# Altium schematic sheet cpu.SchDoc
size A2
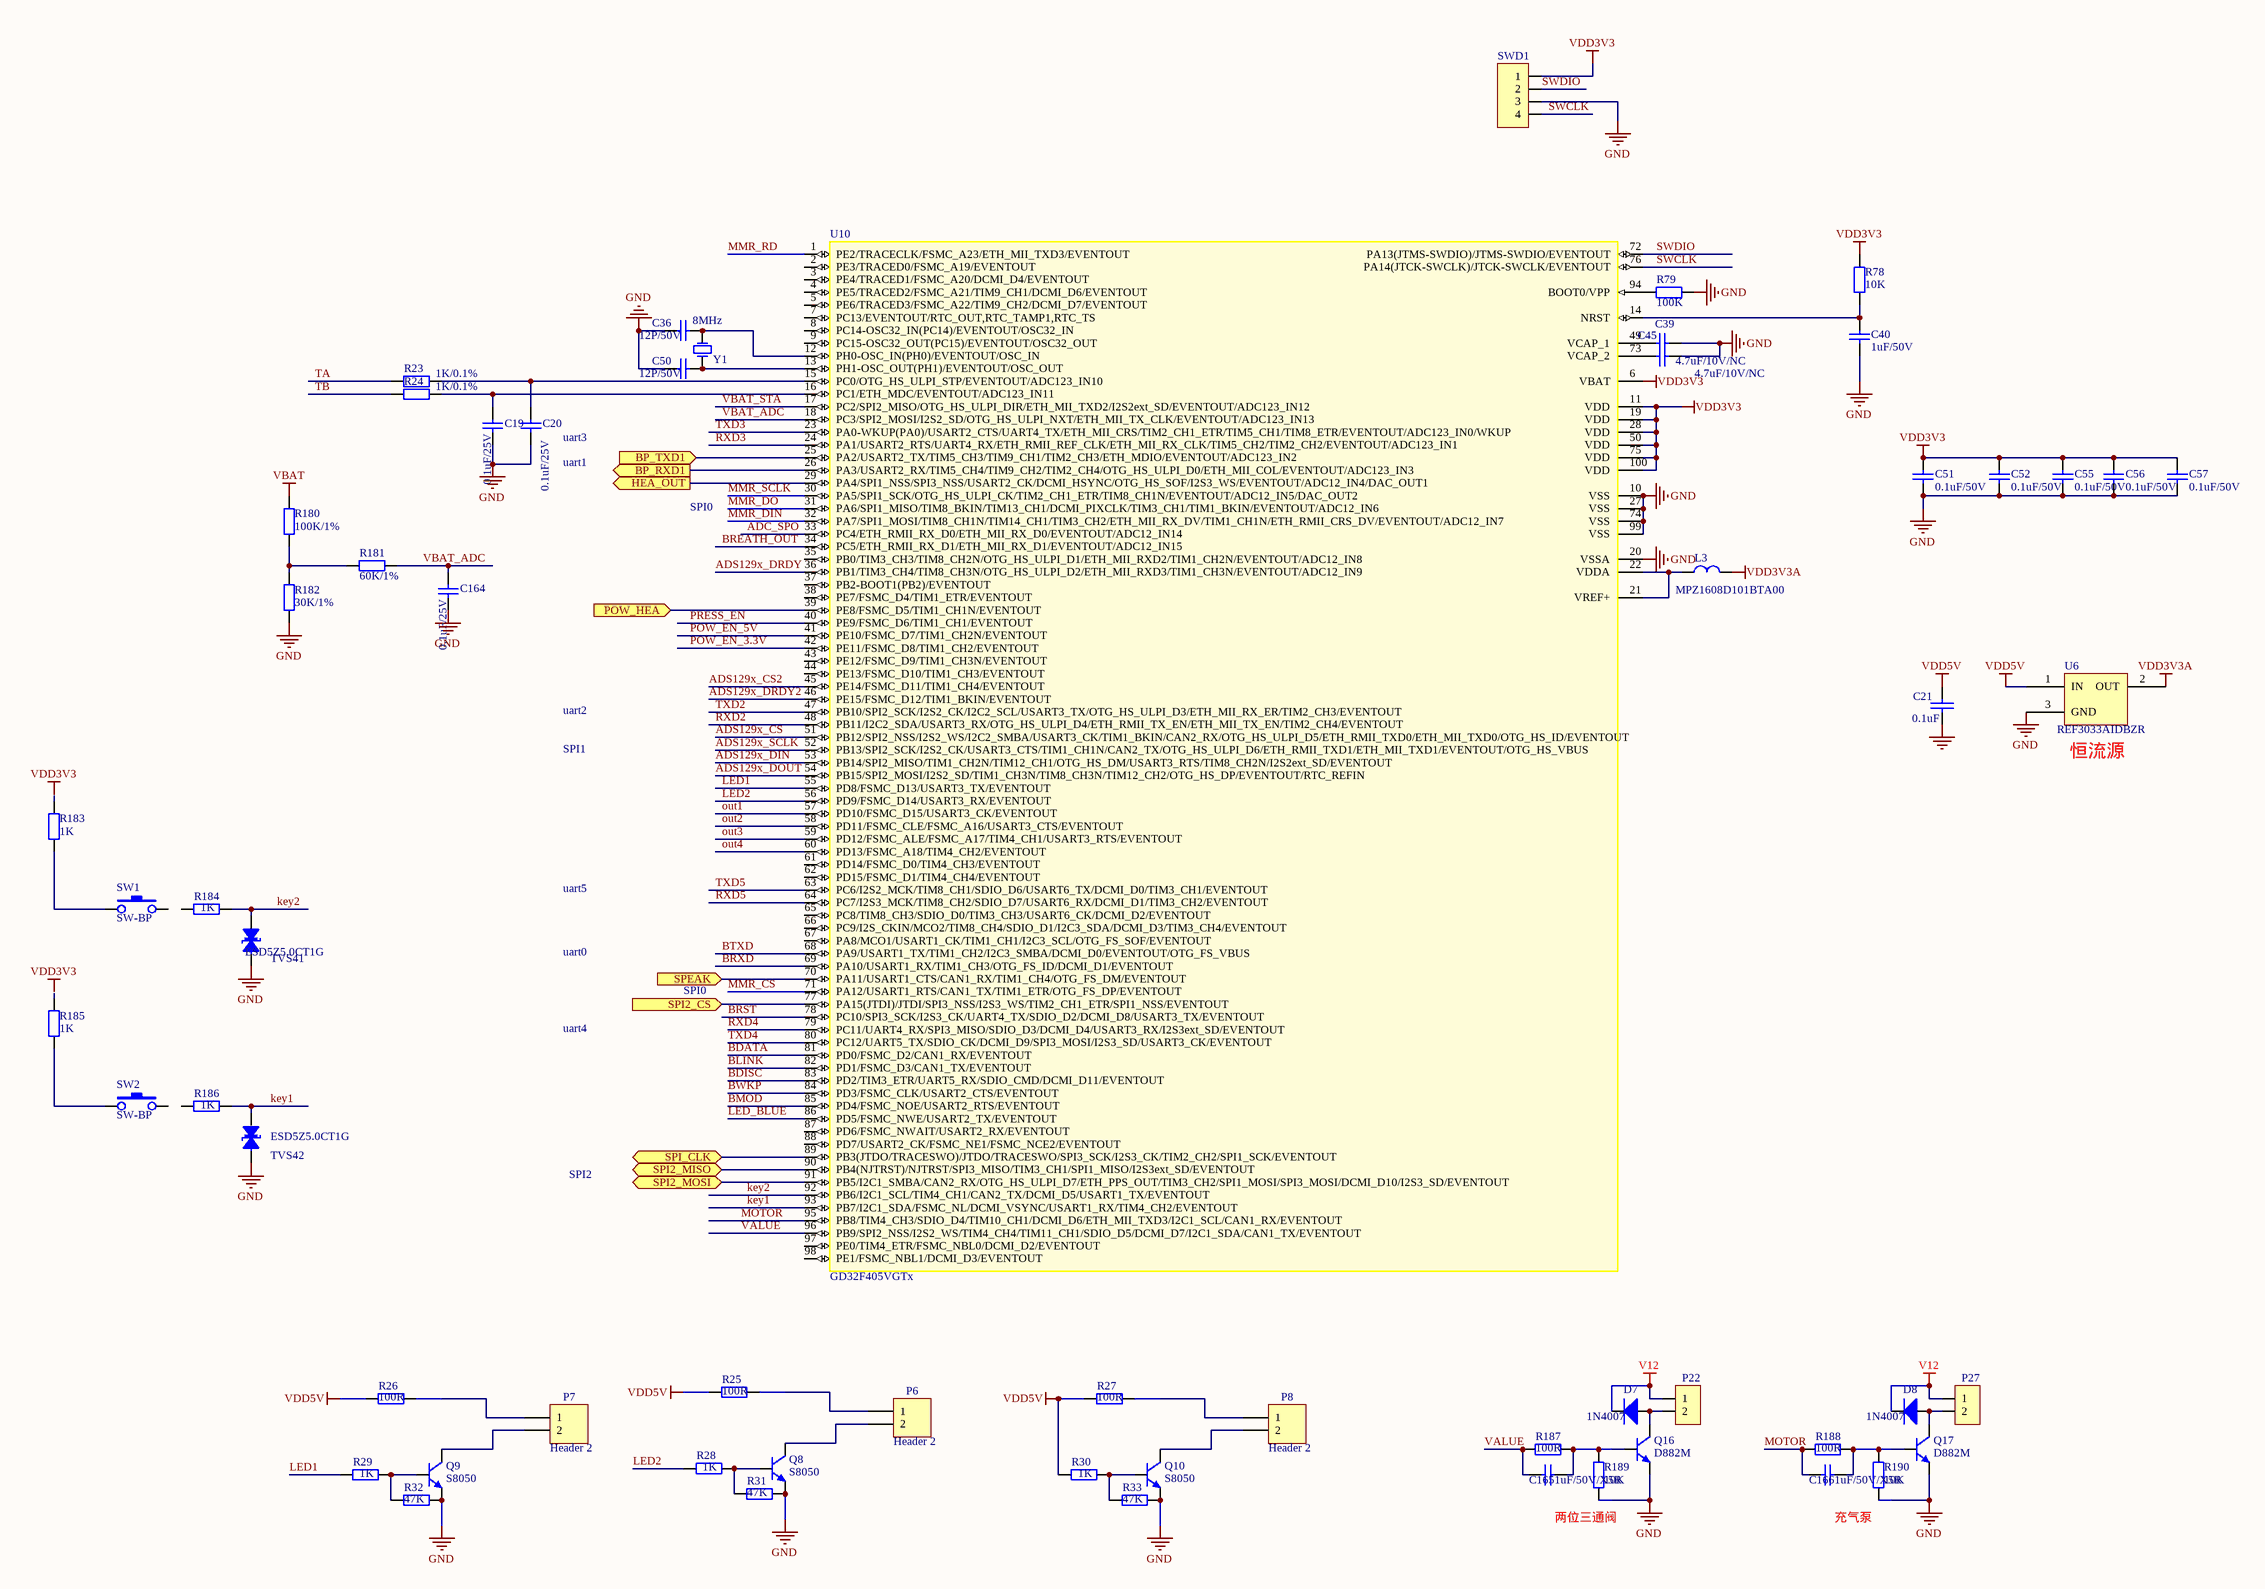
[diagram p0: cpu.SchDoc]

## Parts
C19  0.1uF/25V  [SMD-0603C]
C20  0.1uF/25V  [SMD-0603C]
C21  0.1uF  [0603C]
C36  12P/50V  [SMD-0603C]
C39  4.7uF/10V/NC  [SMD-0603C]
C40  1uF/50V  [SMD-0603C]
C45  4.7uF/10V/NC  [SMD-0603C]
C50  12P/50V  [SMD-0603C]
C51  0.1uF/50V  [SMD-0603C]
C52  0.1uF/50V  [SMD-0603C]
C55  0.1uF/50V  [SMD-0603C]
C56  0.1uF/50V  [SMD-0603C]
C57  0.1uF/50V  [SMD-0603C]
C164  0.1uF/25V  [SMD-0603C]
C165  1uF/50V/X5R  [SMD-0603C]
C166  1uF/50V/X5R  [SMD-0603C]
D7  1N4007  [DO-214-AC]
D8  1N4007  [DO-214-AC]
L3  MPZ1608D101BTA00  [SMD-0603]
P6  Header 2  [2X2.54MMZ]
P7  Header 2  [2X2.54MMZ]
P8  Header 2  [2X2.54MMZ]
P22  VH2.54-2P  [2X2.54MMZ]  (value not drawn)
P27  VH2.54-2P  [2X2.54MMZ]  (value not drawn)
Q8  S8050  [SOT-23]
Q9  S8050  [SOT-23]
Q10  S8050  [SOT-23]
Q16  D882M  [SOT-89-3]
Q17  D882M  [SOT-89-3]
R23  1K/0.1%  [SMD-0603]
R24  1K/0.1%  [SMD-0603]
R25  100R  [SMD-0805]
R26  100R  [SMD-0805]
R27  100R  [SMD-0805]
R28  1K  [SMD-0603]
R29  1K  [SMD-0603]
R30  1K  [SMD-0603]
R31  47K  [SMD-0603]
R32  47K  [SMD-0603]
R33  47K  [SMD-0603]
R78  10K  [SMD-0603]
R79  100K  [SMD-0603]
R180  100K/1%  [SMD-0603]
R181  60K/1%  [SMD-0603]
R182  30K/1%  [SMD-0603]
R183  1K  [SMD-0603]
R184  1K  [SMD-0603]
R185  1K  [SMD-0603]
R186  1K  [SMD-0603]
R187  100R  [SMD-0603]
R188  100R  [SMD-0603]
R189  10K  [SMD-0603]
R190  10K  [SMD-0603]
SW1  SW-BP  [KEY_4X4]
SW2  SW-BP  [KEY_4X4]
SWD1  SIP-4 (NC)  [SIP-4]  (value not drawn)
TVS41  ESD5Z5.0CT1G  [SOD-523]
TVS42  ESD5Z5.0CT1G  [SOD-523]
U6  REF3033AIDBZR  [SOT23-3]
U10  GD32F405VGTx  [STM-LQFP100_N]
Y1  8MHz  [XTAL-3225-2]

## Ports
BP_RXD1 (out), BP_TXD1 (in), HEA_OUT (out), POW_HEA (in), SPEAK (in), SPI2_CS (in), SPI2_MISO (bidir), SPI2_MOSI (bidir), SPI_CLK (bidir)

## Nets
GND: C19.2 C20.2 C21.2 C36.2 C39.1 C40.1 C45.1 C50.2 C51.1 C52.1 C55.1 C56.1 C57.1 C164.2 Q8.2(E) Q9.2(E) Q10.2(E) Q16.3(E) Q17.3(E) R31.2 R32.2 R33.2 R79.1 R182.2 R189.2 R190.2 SWD1.3 TVS41.2(B) TVS42.2(B) U6.3(GND) U10.10(VSS) U10.20(VSSA) U10.27(VSS) U10.74(VSS) U10.99(VSS)
V12: D7.2(K) D8.2(K) P22.1 P27.1
VBAT: R180.1
VDD3V3: C51.2 C52.2 C55.2 C56.2 C57.2 R78.2 SWD1.1 U10.6(VBAT) U10.11(VDD) U10.19(VDD) U10.28(VDD) U10.50(VDD) U10.75(VDD) U10.100(VDD)
VDD3V3A: L3.1 U6.2(OUT)
VDD5V: C21.1 R25.2 R26.2 R27.2 R30.1 U6.1(IN)
ADC_SPO: U10.33(PC4/ETH_RMII_RX_D0/ETH_MII_RX_D0/EVENTOUT/ADC12_IN14)
ADS129x_CS: U10.51(PB12/SPI2_NSS/I2S2_WS/I2C2_SMBA/USART3_CK/TIM1_BKIN/CAN2_RX/OTG_HS_ULPI_D5/ETH_RMII_TXD0/ETH_MII_TXD0/OTG_HS_ID/EVENTOUT)
ADS129x_CS2: U10.45(PE14/FSMC_D11/TIM1_CH4/EVENTOUT)
ADS129x_DIN: U10.53(PB14/SPI2_MISO/TIM1_CH2N/TIM12_CH1/OTG_HS_DM/USART3_RTS/TIM8_CH2N/I2S2ext_SD/EVENTOUT)
ADS129x_DOUT: U10.54(PB15/SPI2_MOSI/I2S2_SD/TIM1_CH3N/TIM8_CH3N/TIM12_CH2/OTG_HS_DP/EVENTOUT/RTC_REFIN)
ADS129x_DRDY: U10.36(PB1/TIM3_CH4/TIM8_CH3N/OTG_HS_ULPI_D2/ETH_MII_RXD3/TIM1_CH3N/EVENTOUT/ADC12_IN9)
ADS129x_DRDY2: U10.46(PE15/FSMC_D12/TIM1_BKIN/EVENTOUT)
ADS129x_SCLK: U10.52(PB13/SPI2_SCK/I2S2_CK/USART3_CTS/TIM1_CH1N/CAN2_TX/OTG_HS_ULPI_D6/ETH_RMII_TXD1/ETH_MII_TXD1/EVENTOUT/OTG_HS_VBUS)
BDATA: U10.81(PD0/FSMC_D2/CAN1_RX/EVENTOUT)
BDISC: U10.83(PD2/TIM3_ETR/UART5_RX/SDIO_CMD/DCMI_D11/EVENTOUT)
BLINK: U10.82(PD1/FSMC_D3/CAN1_TX/EVENTOUT)
BMOD: U10.85(PD4/FSMC_NOE/USART2_RTS/EVENTOUT)
BP_RXD1: U10.26(PA3/USART2_RX/TIM5_CH4/TIM9_CH2/TIM2_CH4/OTG_HS_ULPI_D0/ETH_MII_COL/EVENTOUT/ADC123_IN3) ; port BP_RXD1
BP_TXD1: U10.25(PA2/USART2_TX/TIM5_CH3/TIM9_CH1/TIM2_CH3/ETH_MDIO/EVENTOUT/ADC123_IN2) ; port BP_TXD1
BREATH_OUT: U10.34(PC5/ETH_RMII_RX_D1/ETH_MII_RX_D1/EVENTOUT/ADC12_IN15)
BRST: U10.78(PC10/SPI3_SCK/I2S3_CK/UART4_TX/SDIO_D2/DCMI_D8/USART3_TX/EVENTOUT)
BRXD: U10.69(PA10/USART1_RX/TIM1_CH3/OTG_FS_ID/DCMI_D1/EVENTOUT)
BTXD: U10.68(PA9/USART1_TX/TIM1_CH2/I2C3_SMBA/DCMI_D0/EVENTOUT/OTG_FS_VBUS)
BWKP: U10.84(PD3/FSMC_CLK/USART2_CTS/EVENTOUT)
HEA_OUT: U10.29(PA4/SPI1_NSS/SPI3_NSS/USART2_CK/DCMI_HSYNC/OTG_HS_SOF/I2S3_WS/EVENTOUT/ADC12_IN4/DAC_OUT1) ; port HEA_OUT
key1: R186.2 TVS42.1(A) U10.93(PB7/I2C1_SDA/FSMC_NL/DCMI_VSYNC/USART1_RX/TIM4_CH2/EVENTOUT)
key2: R184.2 TVS41.1(A) U10.92(PB6/I2C1_SCL/TIM4_CH1/CAN2_TX/DCMI_D5/USART1_TX/EVENTOUT)
LED1: R29.1 U10.55(PD8/FSMC_D13/USART3_TX/EVENTOUT)
LED2: R28.1 U10.56(PD9/FSMC_D14/USART3_RX/EVENTOUT)
LED_BLUE: U10.86(PD5/FSMC_NWE/USART2_TX/EVENTOUT)
MMR_CS: U10.71(PA12/USART1_RTS/CAN1_TX/TIM1_ETR/OTG_FS_DP/EVENTOUT)
MMR_DIN: U10.32(PA7/SPI1_MOSI/TIM8_CH1N/TIM14_CH1/TIM3_CH2/ETH_MII_RX_DV/TIM1_CH1N/ETH_RMII_CRS_DV/EVENTOUT/ADC12_IN7)
MMR_DO: U10.31(PA6/SPI1_MISO/TIM8_BKIN/TIM13_CH1/DCMI_PIXCLK/TIM3_CH1/TIM1_BKIN/EVENTOUT/ADC12_IN6)
MMR_RD: U10.1(PE2/TRACECLK/FSMC_A23/ETH_MII_TXD3/EVENTOUT)
MMR_SCLK: U10.30(PA5/SPI1_SCK/OTG_HS_ULPI_CK/TIM2_CH1_ETR/TIM8_CH1N/EVENTOUT/ADC12_IN5/DAC_OUT2)
MOTOR: C166.2 R188.2 U10.95(PB8/TIM4_CH3/SDIO_D4/TIM10_CH1/DCMI_D6/ETH_MII_TXD3/I2C1_SCL/CAN1_RX/EVENTOUT)
out1: U10.57(PD10/FSMC_D15/USART3_CK/EVENTOUT)
out2: U10.58(PD11/FSMC_CLE/FSMC_A16/USART3_CTS/EVENTOUT)
out3: U10.59(PD12/FSMC_ALE/FSMC_A17/TIM4_CH1/USART3_RTS/EVENTOUT)
out4: U10.60(PD13/FSMC_A18/TIM4_CH2/EVENTOUT)
POW_EN_3.3V: U10.42(PE11/FSMC_D8/TIM1_CH2/EVENTOUT)
POW_EN_5V: U10.41(PE10/FSMC_D7/TIM1_CH2N/EVENTOUT)
POW_HEA: U10.39(PE8/FSMC_D5/TIM1_CH1N/EVENTOUT) ; port POW_HEA
PRESS_EN: U10.40(PE9/FSMC_D6/TIM1_CH1/EVENTOUT)
RXD2: U10.48(PB11/I2C2_SDA/USART3_RX/OTG_HS_ULPI_D4/ETH_RMII_TX_EN/ETH_MII_TX_EN/TIM2_CH4/EVENTOUT)
RXD3: U10.24(PA1/USART2_RTS/UART4_RX/ETH_RMII_REF_CLK/ETH_MII_RX_CLK/TIM5_CH2/TIM2_CH2/EVENTOUT/ADC123_IN1)
RXD4: U10.79(PC11/UART4_RX/SPI3_MISO/SDIO_D3/DCMI_D4/USART3_RX/I2S3ext_SD/EVENTOUT)
RXD5: U10.64(PC7/I2S3_MCK/TIM8_CH2/SDIO_D7/USART6_RX/DCMI_D1/TIM3_CH2/EVENTOUT)
SPEAK: U10.70(PA11/USART1_CTS/CAN1_RX/TIM1_CH4/OTG_FS_DM/EVENTOUT) ; port SPEAK
SPI2_CS: U10.77(PA15(JTDI)/JTDI/SPI3_NSS/I2S3_WS/TIM2_CH1_ETR/SPI1_NSS/EVENTOUT) ; port SPI2_CS
SPI2_MISO: U10.90(PB4(NJTRST)/NJTRST/SPI3_MISO/TIM3_CH1/SPI1_MISO/I2S3ext_SD/EVENTOUT) ; port SPI2_MISO
SPI2_MOSI: U10.91(PB5/I2C1_SMBA/CAN2_RX/OTG_HS_ULPI_D7/ETH_PPS_OUT/TIM3_CH2/SPI1_MOSI/SPI3_MOSI/DCMI_D10/I2S3_SD/EVENTOUT) ; port SPI2_MOSI
SPI_CLK: U10.89(PB3(JTDO/TRACESWO)/JTDO/TRACESWO/SPI3_SCK/I2S3_CK/TIM2_CH2/SPI1_SCK/EVENTOUT) ; port SPI_CLK
SWCLK: SWD1.4 U10.76(PA14(JTCK-SWCLK)/JTCK-SWCLK/EVENTOUT)
SWDIO: SWD1.2 U10.72(PA13(JTMS-SWDIO)/JTMS-SWDIO/EVENTOUT)
TA: R23.2
TB: R24.2
TXD2: U10.47(PB10/SPI2_SCK/I2S2_CK/I2C2_SCL/USART3_TX/OTG_HS_ULPI_D3/ETH_MII_RX_ER/TIM2_CH3/EVENTOUT)
TXD3: U10.23(PA0-WKUP(PA0)/USART2_CTS/UART4_TX/ETH_MII_CRS/TIM2_CH1_ETR/TIM5_CH1/TIM8_ETR/EVENTOUT/ADC123_IN0/WKUP)
TXD4: U10.80(PC12/UART5_TX/SDIO_CK/DCMI_D9/SPI3_MOSI/I2S3_SD/USART3_CK/EVENTOUT)
TXD5: U10.63(PC6/I2S2_MCK/TIM8_CH1/SDIO_D6/USART6_TX/DCMI_D0/TIM3_CH1/EVENTOUT)
VALUE: C165.2 R187.2 U10.96(PB9/SPI2_NSS/I2S2_WS/TIM4_CH4/TIM11_CH1/SDIO_D5/DCMI_D7/I2C1_SDA/CAN1_TX/EVENTOUT)
VBAT_ADC: C164.1 R181.2 U10.18(PC3/SPI2_MOSI/I2S2_SD/OTG_HS_ULPI_NXT/ETH_MII_TX_CLK/EVENTOUT/ADC123_IN13)
VBAT_STA: U10.17(PC2/SPI2_MISO/OTG_HS_ULPI_DIR/ETH_MII_TXD2/I2S2ext_SD/EVENTOUT/ADC123_IN12)
NetC19_1: C19.1 R24.1 U10.16(PC1/ETH_MDC/EVENTOUT/ADC123_IN11)
NetC20_1: C20.1 R23.1 U10.15(PC0/OTG_HS_ULPI_STP/EVENTOUT/ADC123_IN10)
NetC36_1: C36.1 U10.12(PH0-OSC_IN(PH0)/EVENTOUT/OSC_IN) Y1.2(OSC2)
NetC39_2: C39.2 U10.49(VCAP_1)
NetC40_2: C40.2 R78.1 U10.14(NRST)
NetC45_2: C45.2 U10.73(VCAP_2)
NetC50_1: C50.1 U10.13(PH1-OSC_OUT(PH1)/EVENTOUT/OSC_OUT) Y1.1(OSC1)
NetC165_1: C165.1 Q16.1(B) R187.1 R189.1
NetC166_1: C166.1 Q17.1(B) R188.1 R190.1
NetD7_1: D7.1(A) P22.2 Q16.2(C)
NetD8_1: D8.1(A) P27.2 Q17.2(C)
NetL3_2: L3.2 U10.21(VREF+) U10.22(VDDA)
NetP6_1: P6.1 R25.1
NetP6_2: P6.2 Q8.3(C)
NetP7_1: P7.1 R26.1
NetP7_2: P7.2 Q9.3(C)
NetP8_1: P8.1 R27.1
NetP8_2: P8.2 Q10.3(C)
NetQ8_1: Q8.1(B) R28.2 R31.1
NetQ9_1: Q9.1(B) R29.2 R32.1
NetQ10_1: Q10.1(B) R30.2 R33.1
NetR79_2: R79.2 U10.94(BOOT0/VPP)
NetR180_2: R180.2 R181.1 R182.1
NetR183_1: R183.1 SW1.1
NetR185_1: R185.1 SW2.1

Not connected (* = marked no-connect by the designer): R183 2; R184 1; R185 2; R186 1; SW1 2; SW2 2; U10 2(PE3/TRACED0/FSMC_A19/EVENTOUT) 3(PE4/TRACED1/FSMC_A20/DCMI_D4/EVENTOUT) 4(PE5/TRACED2/FSMC_A21/TIM9_CH1/DCMI_D6/EVENTOUT) 5(PE6/TRACED3/FSMC_A22/TIM9_CH2/DCMI_D7/EVENTOUT) 7(PC13/EVENTOUT/RTC_OUT,RTC_TAMP1,RTC_TS) 8(PC14-OSC32_IN(PC14)/EVENTOUT/OSC32_IN) 9(PC15-OSC32_OUT(PC15)/EVENTOUT/OSC32_OUT) 35(PB0/TIM3_CH3/TIM8_CH2N/OTG_HS_ULPI_D1/ETH_MII_RXD2/TIM1_CH2N/EVENTOUT/ADC12_IN8) 37(PB2-BOOT1(PB2)/EVENTOUT) 38(PE7/FSMC_D4/TIM1_ETR/EVENTOUT) 43(PE12/FSMC_D9/TIM1_CH3N/EVENTOUT) 44(PE13/FSMC_D10/TIM1_CH3/EVENTOUT) 61(PD14/FSMC_D0/TIM4_CH3/EVENTOUT) 62(PD15/FSMC_D1/TIM4_CH4/EVENTOUT) 65(PC8/TIM8_CH3/SDIO_D0/TIM3_CH3/USART6_CK/DCMI_D2/EVENTOUT) 66(PC9/I2S_CKIN/MCO2/TIM8_CH4/SDIO_D1/I2C3_SDA/DCMI_D3/TIM3_CH4/EVENTOUT) 67(PA8/MCO1/USART1_CK/TIM1_CH1/I2C3_SCL/OTG_FS_SOF/EVENTOUT) 87(PD6/FSMC_NWAIT/USART2_RX/EVENTOUT) 88(PD7/USART2_CK/FSMC_NE1/FSMC_NCE2/EVENTOUT) 97(PE0/TIM4_ETR/FSMC_NBL0/DCMI_D2/EVENTOUT) 98(PE1/FSMC_NBL1/DCMI_D3/EVENTOUT)

## Notes on the sheet
- (near C20) uart1
- (near C20) uart3
- SPI0
- uart2
- SPI1
- (near U6) 恒流源
- uart5
- uart0
- uart4
- SPI2
- 两位三通阀
- 充气泵
- Labels drawn without touching a wire or pin: VDD3V3

## Library data of the parts
C19 C20 C36 C50 C164 = CAP4: 贴片电容 5%
C21 = CAP: Capacitor
C39 C40 C45 C51 C52 C55-C57 C165 C166 = CAP4: 贴片电容 20%
D7 D8 = DIODE2: 二极管 M7
L3 = CIZHU1: 磁珠电感 100R 100MHz
P6-P8 = Header 2: Header, 2-Pin; LatestRevisionDate: 17-Jul-2002; LatestRevisionNote: Re-released for DXP Platform.; Publisher: Altium Limited
P22 P27 = SIP-2: 2.54mm- 2P立贴
Q8-Q10 = NPN-1: NPN
Q16 Q17 = NPN-TO252: NPN TO252
R23 R24 = R: 贴片电阻 1%
R25-R33 = RES0: 贴片电阻 5%
R78 R79 R180-R182 = RES2: 贴片电阻 5%
R183-R186 = R: 贴片电阻 5%
R187-R190 = RES-SOP: 贴片电阻 5%
SW1 SW2 = SW-BP: 3*6*3.5侧贴按键(编带)
SWD1 = SIP-4: ISP 下载
TVS41 TVS42 = TVS-1: ESD二极管
U6 = REF3012
U10 = STM32F405VGTx: Manufacturer: STMicroelectronics; PartNumber: STM32F405VGT6; Core: ARM Cortex-M4; D/A Converter: 2x12-bit; FLASH Size (Prog) (kB): 1024; I/Os (High Current): 82; Internal RAM Size (kB): 192; Operating Frequency(F) (Processor speed) (MHz): 168; Packing: Tray; Supply Voltage(Vcc) max (V): 3.6; Supply Voltage(Vcc) min (V): 1.8; DatasheetVersion: Rev. 4; PackageVersion: Rev. 1, 06/2013; PackageReference: LQFP100; PackageDescription: 100-Pin Low Profile Quad Flat Package, 14 x 14 mm Body, 0.5 mm Pitch; Mounting Technology: Surface Mount; ComponentLink1Description: Manufacturer URL; ComponentLink1URL: http://www.st.com/web/en/home.html; ComponentLink2Description: Datasheet; ComponentLink2URL: http://www.st.com/st-web-ui/static/active/en/resource/technical/document/datasheet/DM00037051.pdf; ComponentLink3Description: Package Specification; ComponentLink3URL: http://www.st.com/st-web-ui/static/active/en/resource/technical/document/data_brief/DM00071938.pdf
Y1 = XTAL: 3225 贴片晶振